# Altium schematic sheet optoparaE3.SchDoc
size 209 x 297 mm; SheetNumber: 1; SheetTotal: 1
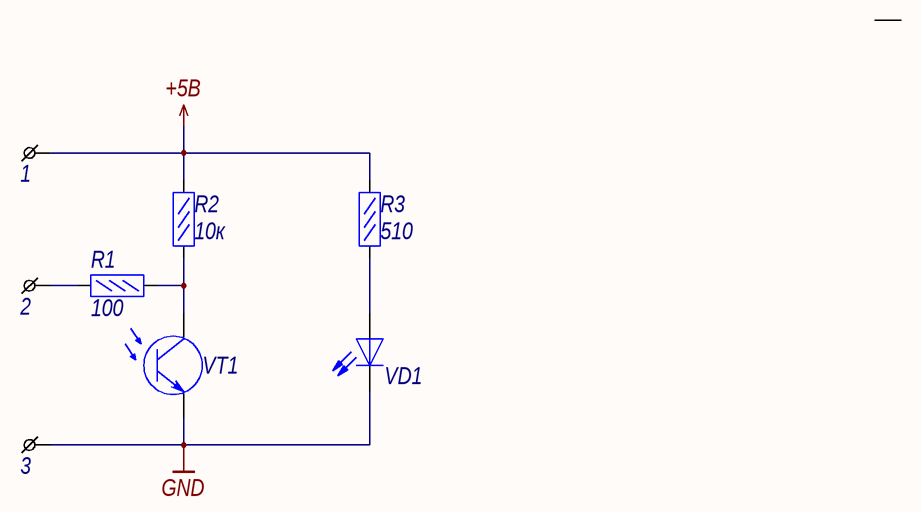
[diagram p0: optoparaE3.SchDoc]

## Parts
1  MNT_HOLE  [TP_1X1]  (value not drawn)  (no BOM)
2  MNT_HOLE  [TP_1X1]  (value not drawn)  (no BOM)
3  MNT_HOLE  [TP_1X1]  (value not drawn)  (no BOM)
R1  100  [R0603]
R2  10к  [R0603]
R3  510  [R0603]
VD1  (no value)  [LED_5mm]
VT1  -  [LED_5mm]  (value not drawn)

## Nets
+5В: 1.1 R2.2 R3.2
GND: 3.1 VD1.2(K) VT1.2
Net2_1: 2.1 R1.1
NetR1_2: R1.2 R2.1 VT1.1
NetR3_1: R3.1 VD1.1(A)

## Notes on the sheet
- Перв. примен.
- Справ. №
- Подп. и дата
- Инв. № дубл.
- Взам. инв. №
- Изм.
- Лист
- № докум.
- Подп.
- Дата
- Лит.
- Масса
- Масштаб
- Т.контр.
- Пров.
- Разраб.
- Листов
- Инв. № подл.
- Н.контр.
- Файл:
- Утв.
- Копировал
- Формат

## Library data of the parts
R1 = RC0603FR-07100RL: Резистор 100 Ом 0,1Вт 1%; Manufacturer: YAGEO; Name: RC0603FR-07100RL; Tolerance: 1%; Value: 100
R2 = RC0603FR-0710KL: Резистор 10кОм 0,063Вт 1%; Manufacturer: YAGEO; Name: RC0603FR-0710KL; Tolerance: 1%; Value: 10к
R3 = RC0603FR-07510RL: Резистор 510 Ом 0,1Вт 1%; Manufacturer: YAGEO; Name: RC0603FR-07510RL; Tolerance: 1%; Value: 510
VD1 = IR_LED: ИК светодиод
VT1 = BJTfoto: Биполярный NPN транзистор; TU: -; Manufacturer: -; Name: -